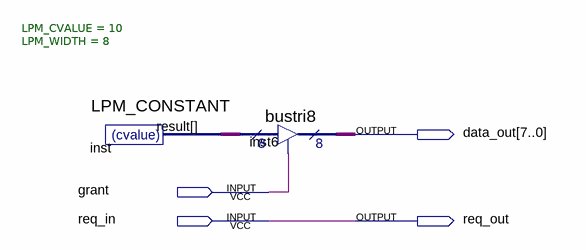
[diagram p0: schematic sheet]
// Quartus schematic master1.bdf as structural Verilog: 2 symbols, 4 pins
module master1 (
  input  grant,
  input  req_in,
  output [7:0] data_out,
  output req_out
);

  wire [7:0] inst_result;

  LPM_CONSTANT #(.LPM_CVALUE(10), .LPM_WIDTH(8)) inst (.result(inst_result));
  bustri8 inst6 (.enabledt(grant), .data(inst_result), .tridata(data_out));

  assign req_out = req_in;
endmodule
